# EAGLE schematic schematic (EAGLE 7.6.0)
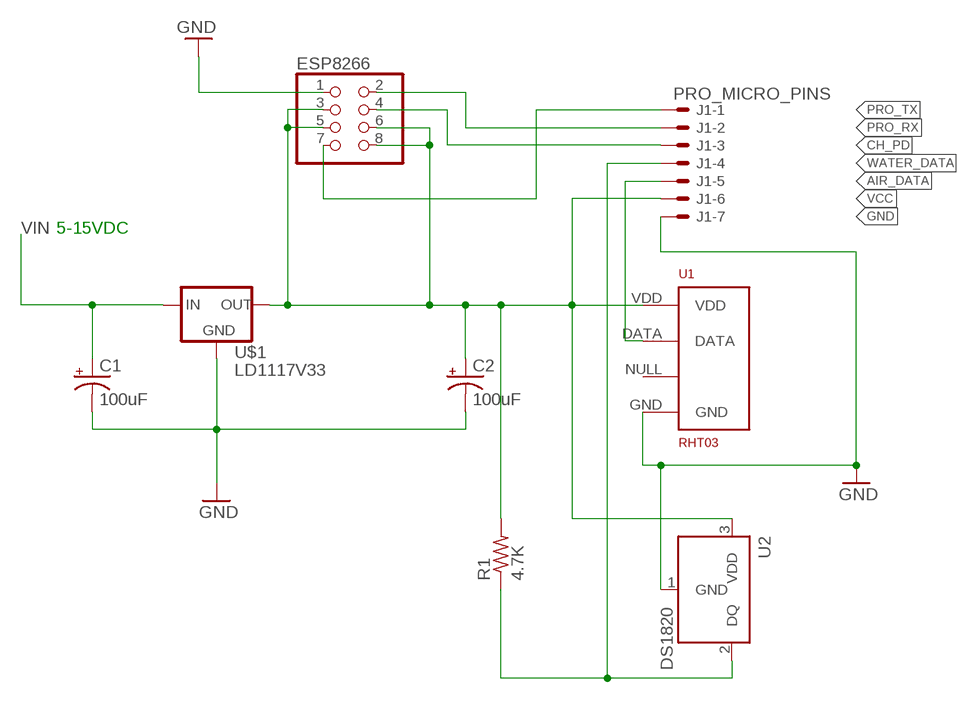
[diagram p0: schematic, sheet 1]

## Parts
C1  100uF  100UF-25V-20%(PTH)  [CPOL-RADIAL-100UF-25V]
C2  100uF  100UF-25V-20%(PTH)  [CPOL-RADIAL-100UF-25V]
ESP8266  PINHD-2X4  [2X04]
J1  PRO_MICRO_PINS  22-23-2071  [22-23-2071]
R1  4.7K  R-US_0207/10  [0207/10]
U1  RHT03  RHT03_DHT-22_AM2302  [RHT03_DHT-22]
U2  DS1820  [TO-92]
U$1  LD1117V33  V_REG_LD1117VXX  [78XXL]

## Nets
AIR_DATA: J1.5 U1.DATA
CH_PD: ESP8266.4 J1.3
GND: C1.2(-) C2.2(-) ESP8266.1 J1.7 U1.GND U2.1(GND) U$1.IN(GND)
PRO_RX: ESP8266.2 J1.2
PRO_TX: ESP8266.7 J1.1
VCC: C2.1(+) ESP8266.3 ESP8266.5 ESP8266.6 ESP8266.8 J1.6 R1.2 U1.VDD U2.3(VDD) U$1.GND(OUT)
VIN: C1.1(+) U$1.OUT(IN)
WATER_DATA: J1.4 R1.1 U2.2(DQ)
Unconnected: U1.NULL

## Notes on the sheet
- 5-15VDC

## Library data of the parts
C1 C2 = SparkFun-Capacitors:100UF-25V-20%(PTH): CAP-08439; PROD_ID: CAP-08439
ESP8266 = pinhead:PINHD-2X4: PIN HEADER
J1 = con-molex:22-23-2071: .100" (2.54mm) Center Header - 7 Pin; MF: MOLEX; MPN: 22-23-2071; OC_FARNELL: 1654534; OC_NEWARK: 56H0445
R1 = resistor:R-US_: RESISTOR, American symbol
U1 = RHT03_DHT-22_AM2302:RHT03_DHT-22_AM2302: RHT03 / DHT-22 / AM2302 Packages and symbol for the RHT03 / DHT-22 relative humidity and temperature sensor. Note: The AM2302 is a wired version of the DHT-22 which typically requires less clearance and is thus provided as a separate package.; PROD_ID: SEN-10167
U2 = DS1820:DS1820: DS1820 - 1-Wire Digital Thermometer
U$1 = SparkFun-PowerIC:V_REG_LD1117VXX: LD1117VXX voltage regulator. We carry the 3.3V version (COM-00526) in TO-220 package.